# Altium schematic sheet Sheet1.SchDoc
size A4
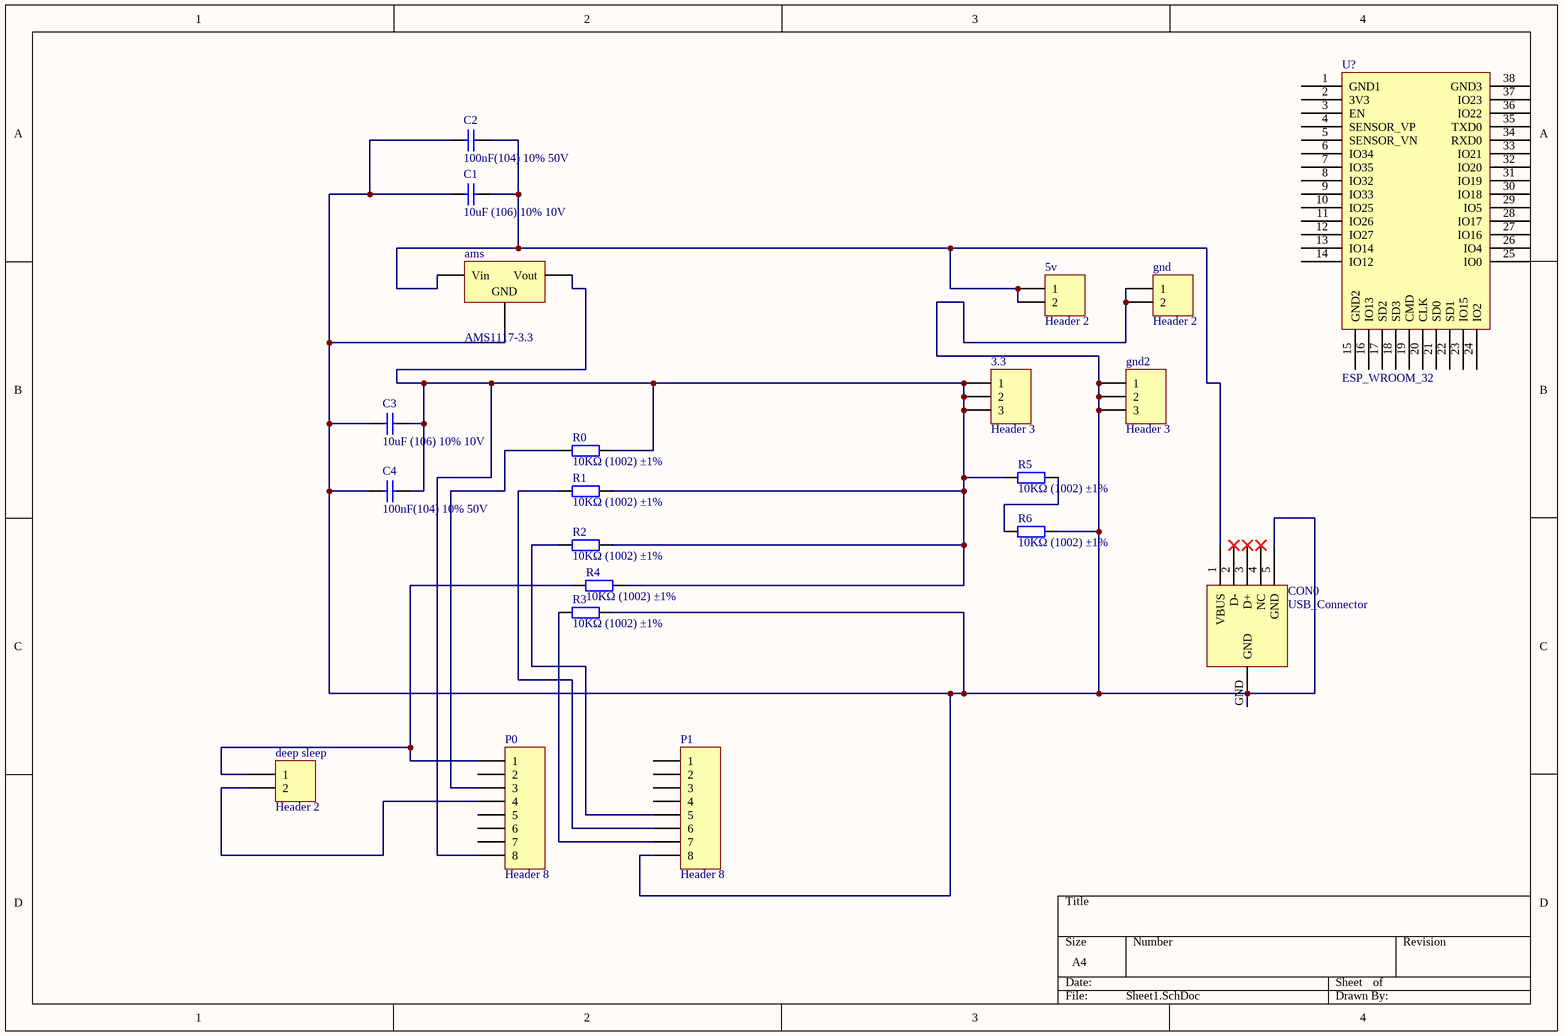
[diagram p0: Sheet1.SchDoc]

## Parts
3.3  Header 3  [HDR1X3]
5v  Header 2  [HDR1X2]
ams  AMS1117-3.3  [LC-SOT-223]
C1  10uF (106) 10% 10V  [LC-0603_C]
C2  100nF(104) 10% 50V  [LC-0805_C]
C3  10uF (106) 10% 10V  [LC-0603_C]
C4  100nF(104) 10% 50V  [LC-0805_C]
CON0  USB_Connector  [MicroUSB]
deep_sleep  Header 2  [HDR1X2]
gnd  Header 2  [HDR1X2]
gnd2  Header 3  [HDR1X3]
P0  Header 8  [HDR1X8]
P1  Header 8  [HDR1X8]
R0  10KΩ (1002) ±1%  [LC-0805_R]
R1  10KΩ (1002) ±1%  [LC-0805_R]
R2  10KΩ (1002) ±1%  [LC-0805_R]
R3  10KΩ (1002) ±1%  [LC-0805_R]
R4  10KΩ (1002) ±1%  [LC-0805_R]
R5  10KΩ (1002) ±1%  [LC-0805_R]
R6  10KΩ (1002) ±1%  [LC-0805_R]
U?  ESP_WROOM_32  [ESP_WROOM_32]

## Nets
Net3.3_1: 3.3.1 3.3.2 3.3.3 ams.2(Vout) C3.2 C4.2 P0.8 R0.2 R1.2 R2.2 R4.2 R5.1
Net5v_1: 5v.1 5v.2 ams.3(Vin) C1.2 C2.2 CON0.1(VBUS)
Netams_1: ams.1(GND) C1.1 C2.1 C3.1 C4.1 CON0.5(GND) CON0.GND gnd.1 gnd.2 gnd2.1 gnd2.2 gnd2.3 P1.8 R3.2 R6.2
Netdeep_sleep_1: deep_sleep.1 P0.1 R4.1
Netdeep_sleep_2: deep_sleep.2 P0.4
NetP0_3: P0.3 R0.1
NetP1_5: P1.5 R2.1
NetP1_6: P1.6 R1.1
NetP1_7: P1.7 R3.1
NetR5_2: R5.2 R6.1

Not connected (* = marked no-connect by the designer): CON0 2(D-)* 3(D+)* 4(NC)*; P0 2 5 6 7; P1 1 2 3 4; U? 1(GND1) 2(3V3) 3(EN) 4(SENSOR_VP) 5(SENSOR_VN) 6(IO34) 7(IO35) 8(IO32) 9(IO33) 10(IO25) 11(IO26) 12(IO27) 13(IO14) 14(IO12) 15(GND2) 16(IO13) 17(SD2) 18(SD3) 19(CMD) 20(CLK) 21(SD0) 22(SD1) 23(IO15) 24(IO2) 25(IO0) 26(IO4) 27(IO16) 28(IO17) 29(IO5) 30(IO18) 31(IO19) 32(IO20) 33(IO21) 34(RXD0) 35(TXD0) 36(IO22) 37(IO23) 38(GND3)

## Library data of the parts
3.3 gnd2 = Header 3: Header, 3-Pin; LatestRevisionDate: 17-Jul-2002; LatestRevisionNote: Re-released for DXP Platform.; Publisher: Altium Limited
5v deep_sleep gnd = Header 2: Header, 2-Pin; LatestRevisionDate: 17-Jul-2002; LatestRevisionNote: Re-released for DXP Platform.; Publisher: Altium Limited
ams = SOT-223 AMS1117-3.3: 低压差线性稳压(LDO); ComponentLink1Description: 供应商链接; ComponentLink1URL: http://www.szlcsc.com/product/details_6652.html; Package: SOT-223; Supplier: LC; SuppliersPartNumber: C6186
C1 C3 = 0603 10uF (106) 10% 10V: 贴片电容; ComponentLink1Description: 供应商链接; ComponentLink1URL: http://www.szlcsc.com/product/details_20411.html; Package: 0603; Supplier: LC; SuppliersPartNumber: C19702
C2 C4 = 0805 100nF(104) 10% 50V: 贴片电容; ComponentLink1Description: 供应商链接; ComponentLink1URL: http://www.szlcsc.com/product/details_50686.html; Package: 0805; Supplier: LC; SuppliersPartNumber: C49678
P0 P1 = Header 8: Header, 8-Pin; LatestRevisionDate: 17-Jul-2002; LatestRevisionNote: Re-released for DXP Platform.; Publisher: Altium Limited
R0-R6 = 0805 10KΩ (1002) 1%: 贴片电阻; ComponentLink1Description: 供应商链接; ComponentLink1URL: http://www.szlcsc.com/product/details_18102.html; Package: 0805; Supplier: LC; SuppliersPartNumber: C17414